# Altium schematic sheet Interfaz de Usuario.SchDoc
size Letter; Author: Jose Alberto Balderas Castillo; Organization: Altium Limited; Address1: L3, 12a Rodborough Rd; Address2: Frenchs Forest; Address3: NSW; Address4: Australia 2086
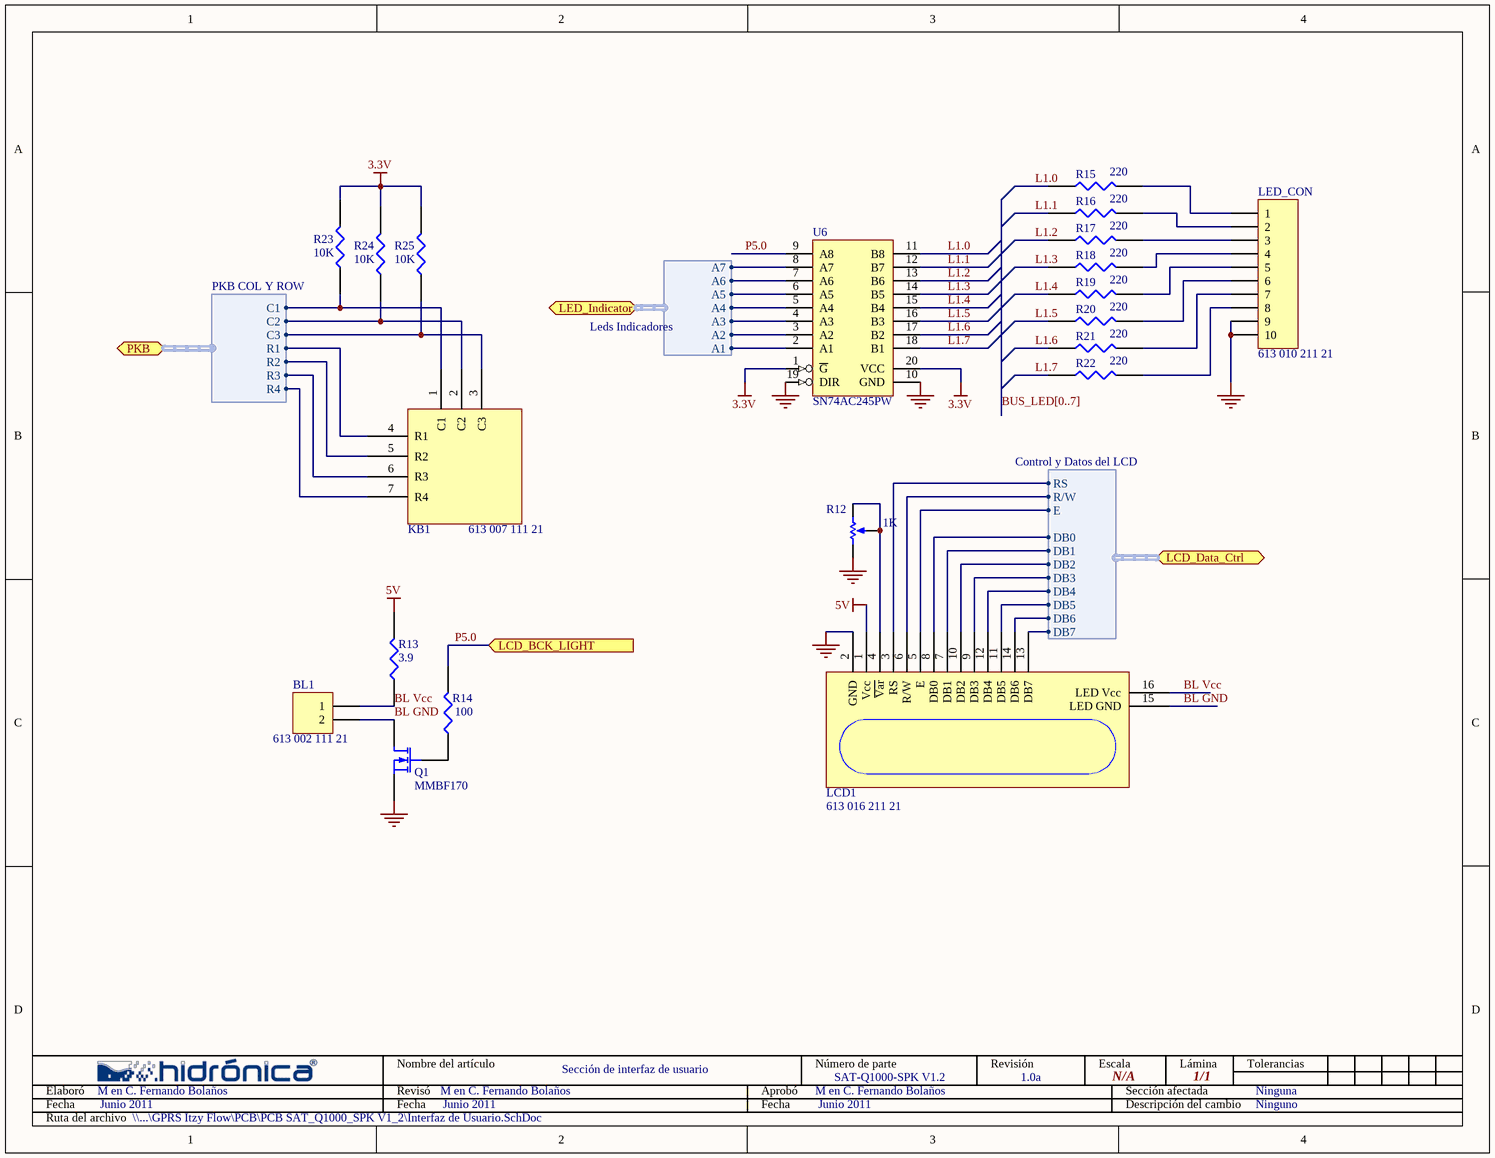
[diagram p0: Interfaz de Usuario.SchDoc]

## Parts
BL1  613 002 111 21  [PIN2]
KB1  613 007 111 21  [HDR1X7]
LCD1  613 016 211 21  [HDR2X8]
LED_CON  613 010 211 21  [HDR2X5]
Q1  MMBF170  [sot-23]
R12  1K  [TS63Y502K Res Var]
R13  3.9  [1206]
R14  value 100  [1206]
R15  220  [1206]
R16  220  [1206]
R17  220  [1206]
R18  220  [1206]
R19  220  [1206]
R20  220  [1206]
R21  220  [1206]
R22  220  [1206]
R23  10K  [1206]
R24  10K  [1206]
R25  10K  [1206]
U6  SN74AC245PW  [TSSOP-20-PW]

## Ports
LCD_BCK_LIGHT (in), LCD_Data_Ctrl (harness Control y Datos del LCD), LED_Indicator (harness Leds Indicadores), PKB (harness PKB COL Y ROW)

## Harnesses
PKB COL Y ROW: C1, C2, C3, R1, R2, R3, R4
Leds Indicadores: A1, A2, A3, A4, A5, A6, A7
Control y Datos del LCD: E, RS, R/W, DB0, DB1, DB2, DB3, DB4, DB5, DB6, DB7

## Nets
3.3V: R23.2 R24.2 R25.2 U6.1(~{G}) U6.20(VCC)
5V: LCD1.1(Vcc) R13.2
GND: LCD1.2(GND) LED_CON.9 LED_CON.10 Q1.2(S) R12.1(TOP) U6.10(GND) U6.19(DIR)
BL GND: BL1.2 LCD1.15(LED_GND) Q1.3(D)
BL Vcc: BL1.1 LCD1.16(LED_Vcc) R13.1
L1.0: R15.1 U6.11(B8)
L1.1: R16.1 U6.12(B7)
L1.2: R17.1 U6.13(B6)
L1.3: R18.1 U6.14(B5)
L1.4: R19.1 U6.15(B4)
L1.5: R20.1 U6.16(B3)
L1.6: R21.1 U6.17(B2)
L1.7: R22.1 U6.18(B1)
P5.0: R14.2 U6.9(A8) ; port LCD_BCK_LIGHT
NetKB1_1: KB1.1(C1) R23.1 ; port PKB.C1
NetKB1_2: KB1.2(C2) R24.1 ; port PKB.C2
NetKB1_3: KB1.3(C3) R25.1 ; port PKB.C3
NetKB1_4: KB1.4(R1) ; port PKB.R1
NetKB1_5: KB1.5(R2) ; port PKB.R2
NetKB1_6: KB1.6(R3) ; port PKB.R3
NetKB1_7: KB1.7(R4) ; port PKB.R4
NetLCD1_3: LCD1.3(RS) ; port LCD_Data_Ctrl.RS
NetLCD1_4: LCD1.4(~{Var}) R12.2(BOT) R12.3(TAP)
NetLCD1_5: LCD1.5(E) ; port LCD_Data_Ctrl.E
NetLCD1_6: LCD1.6(R/W) ; port LCD_Data_Ctrl.R/W
NetLCD1_7: LCD1.7(DB1) ; port LCD_Data_Ctrl.DB1
NetLCD1_8: LCD1.8(DB0) ; port LCD_Data_Ctrl.DB0
NetLCD1_9: LCD1.9(DB3) ; port LCD_Data_Ctrl.DB3
NetLCD1_10: LCD1.10(DB2) ; port LCD_Data_Ctrl.DB2
NetLCD1_11: LCD1.11(DB5) ; port LCD_Data_Ctrl.DB5
NetLCD1_12: LCD1.12(DB4) ; port LCD_Data_Ctrl.DB4
NetLCD1_13: LCD1.13(DB7) ; port LCD_Data_Ctrl.DB7
NetLCD1_14: LCD1.14(DB6) ; port LCD_Data_Ctrl.DB6
NetLED_CON_1: LED_CON.1 R15.2
NetLED_CON_2: LED_CON.2 R16.2
NetLED_CON_3: LED_CON.3 R17.2
NetLED_CON_4: LED_CON.4 R18.2
NetLED_CON_5: LED_CON.5 R19.2
NetLED_CON_6: LED_CON.6 R20.2
NetLED_CON_7: LED_CON.7 R21.2
NetLED_CON_8: LED_CON.8 R22.2
NetQ1_1: Q1.1(G) R14.1
NetU6_2: U6.2(A1) ; port LED_Indicator.A1
NetU6_3: U6.3(A2) ; port LED_Indicator.A2
NetU6_4: U6.4(A3) ; port LED_Indicator.A3
NetU6_5: U6.5(A4) ; port LED_Indicator.A4
NetU6_6: U6.6(A5) ; port LED_Indicator.A5
NetU6_7: U6.7(A6) ; port LED_Indicator.A6
NetU6_8: U6.8(A7) ; port LED_Indicator.A7

## Buses and harness runs
bus BUS_LED[0..7]

## Notes on the sheet
- M en C. Fernando Bolaños
- Junio 2011
- Sección de interfaz de usuario
- SAT-Q1000-SPK V1.2
- 1.0a
- Ninguna
- Ninguno
- \\...\GPRS Itzy Flow\PCB\PCB SAT_Q1000_SPK V1_2\Interfaz de Usuario.SchDoc
- Elaboró
- Fecha
- Nombre del artículo
- Revisó
- Aprobó
- Número de parte
- Revisión
- Escala
- N/A
- Sección afectada
- Descripción del cambio
- Lámina
- 1/1
- Tolerancias
- Ruta del archivo

## Library data of the parts
BL1 = Header 2: 2.54mm Pin Header WR-PHD; Revision: 17-Jul-2002: Re-released for DXP Platform.; Publisher: Altium Limited; Supplier 1: Wurth Elektronik; Numero de Parte: 613 002 111 21; Supplier Part Number 1: 613 002 111 21
KB1 = Teclado 4x3: 2.54mm Pin Header WR-PHD; Numero de Parte: 613 007 111 21; Supplier Part Number 1: 613 007 111 21; Supplier 1: Wurth Elektronik
LCD1 = LCD 2x20 P: 2.54mm Dual Pin Header WR-PHD; Value: 20 x 2 LCD; Numero de Parte: 613 016 211 21; Supplier Part Number 1: 613 016 211 21; Supplier 1: Wurth Elektronik
LED_CON = Header 10: 2.54mm Dual Pin Header WR-PHD; Revision: 17-Jul-2002: Re-released for DXP Platform.; Publisher: Altium Limited; Supplier Part Number 1: 613 010 211 21; Supplier 1: Wurth Elektronik; Numero de Parte: 613 010 211 21
Q1 = MOSFET-N: N-Channel MOSFET; Published: 8-Jun-2000; Revision: July-2002: Re-released for DXP Platform.; Publisher: Altium Limited; Numero de Parte: MMBF170; Supplier 1: Newark; Supplier Part Number 1: 58K9427
R12 = RPot: Potentiometer; Numero de Parte: TS63Y102KR10; Set Position: 0.5; Published: 8-Jun-2000; Revision: July-2002: Re-released for DXP Platform.; Publisher: Altium Limited; Value: 1K; Supplier 1: Digi-Key; Supplier Part Number 1: TS63Y-1.0KCT-ND
R13 = RES1: RESISTOR 3.9 OHM 1/4W 5% 1206; Numero de Parte: ERJ-8GEYJ3R9V; Value: 3.9; Supplier 1: Digi-Key; Supplier Part Number 1: P3.9EDKR-ND
R14 = RES1: Numero de Parte: ERJ-8GEYJ101V; Supplier Part Number: P100ECT-ND; Supplier: DigiKey; Supplier 1: Digi-Key; Supplier Part Number 1: P100EDKR-ND
R15-R22 = RES1: RES 220 OHM 1/4W 5% 1206 SMD; Numero de Parte: ERJ-8GEYJ221V; Value: 220; Supplier Part Number: P220ECT-ND; Supplier: DigiKey; Supplier 1: Digi-Key; Supplier Part Number 1: P220EDKR-ND
R23-R25 = RES1: RES 10K OHM 1/4W 5% 1206 SMD; Numero de Parte: ERJ-8GEYJ103V; Value: 10K; Supplier Part Number 1: P10KECT-ND; Supplier 1: DigiKey; Supplier 2: Digi-Key; Supplier Part Number 2: P10KEDKR-ND
U6 = SN74AC245PW: Numero de Parte: SN74AC245PW; Supplier 1: Newark; Supplier Part Number 1: 50R5843